# EAGLE design kameleon-core (EAGLE 9.4.2)
Kameleon Schematic
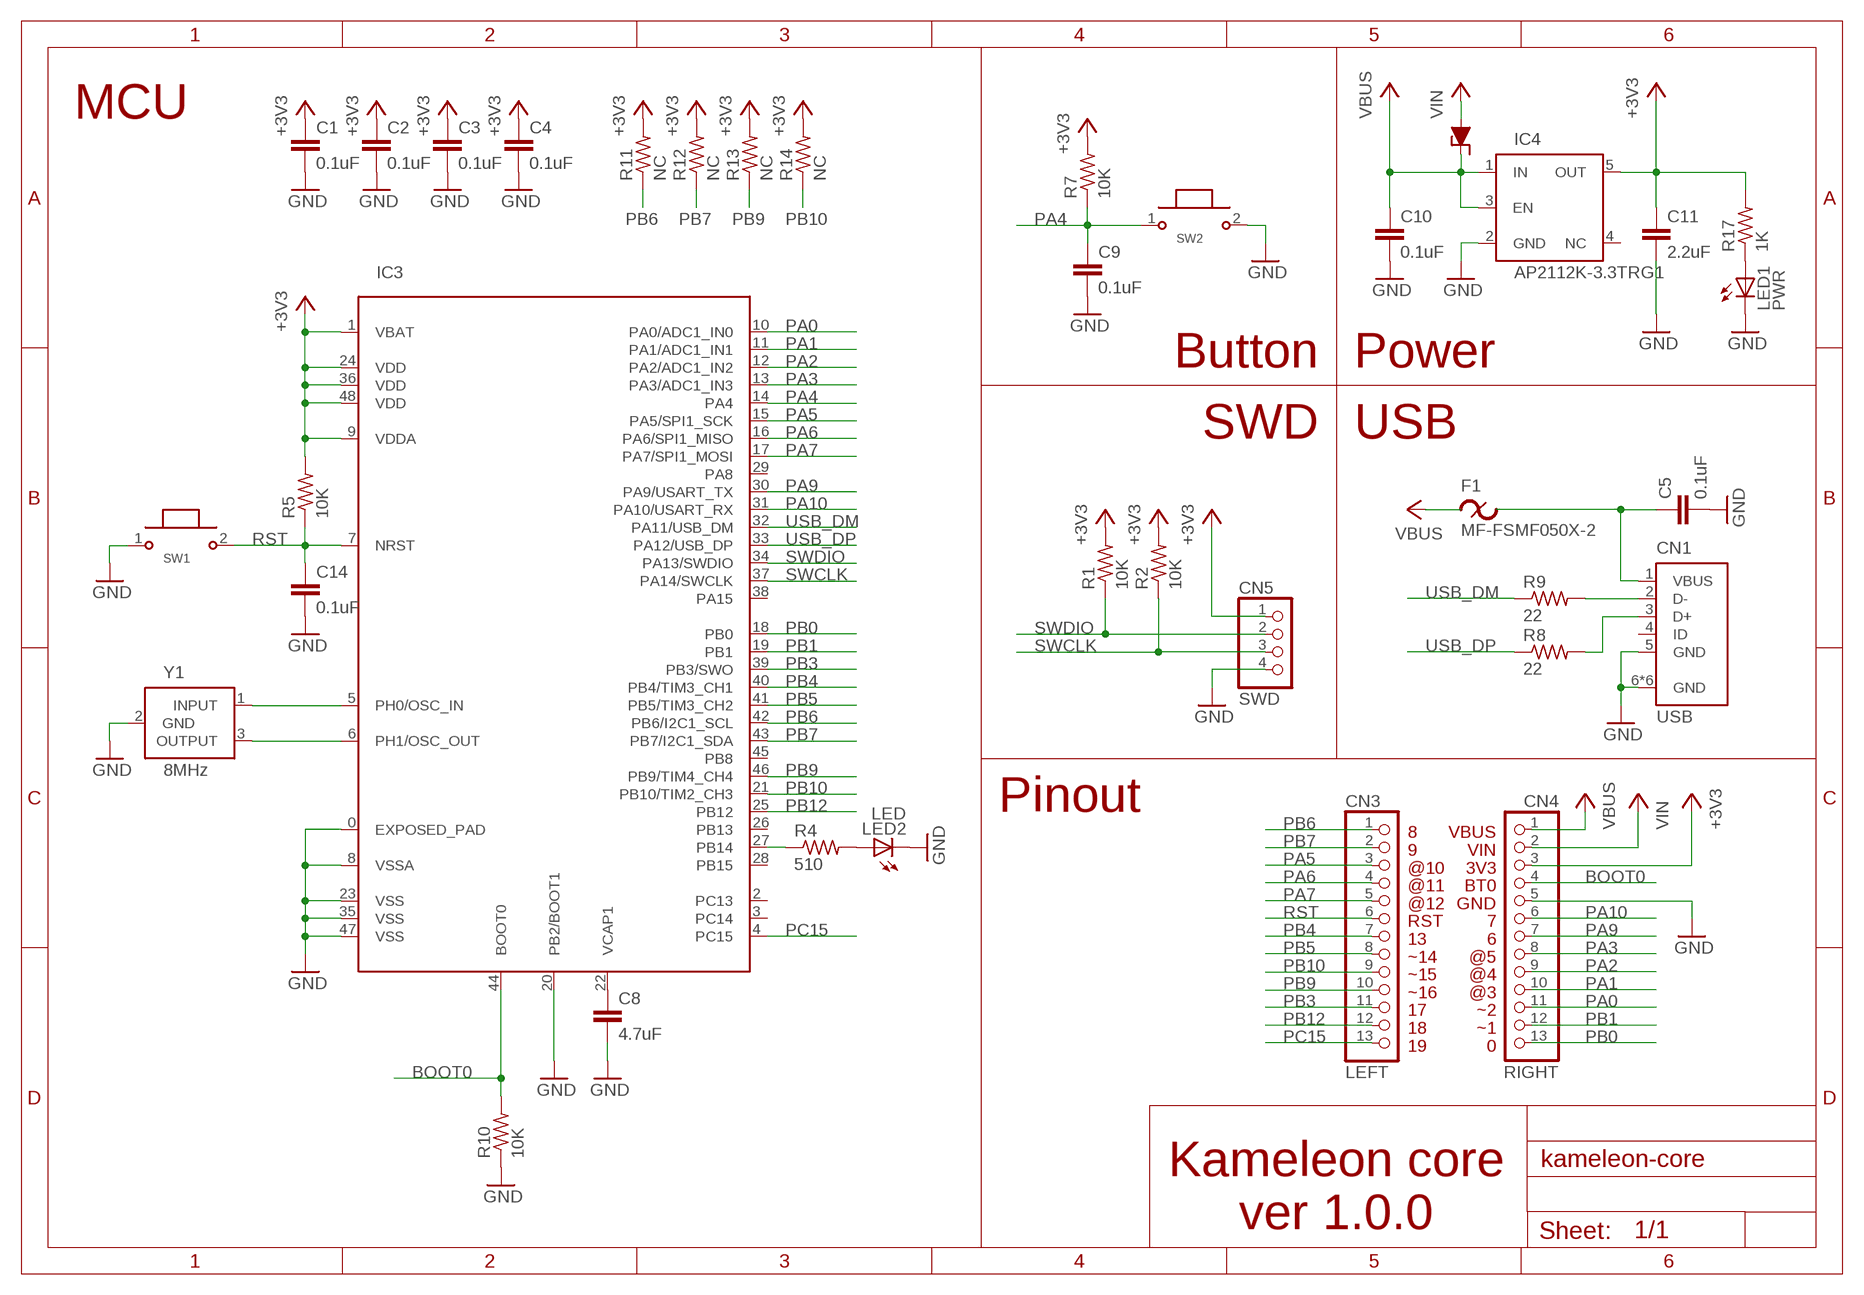
[diagram p0: schematic, sheet 1]

## Parts
C1  0.1uF  CAP  [1608]
C2  0.1uF  CAP  [1608]
C3  0.1uF  CAP  [1608]
C4  0.1uF  CAP  [1608]
C5  0.1uF  CAP  [1608]
C8  4.7uF  CAPB  [2012]
C9  0.1uF  CAP  [1608]
C10  0.1uF  CAP  [1608]
C11  2.2uF  CAPB  [2012]
C14  0.1uF  CAP  [1608]
CN1  USB  1050170001  [1050170001]
CN3  LEFT  PINHD-1X13  [1X13]
CN4  RIGHT  PINHD-1X13  [1X13]
CN5  SWD  PINHD-1X4  [1X04]
D1  MBR120VLSF  [SOD-123FL]
F1  MF-FSMF050X-2  [1608]
IC3  STM32F411CE/UFQFPN48  [UFQFPN48]
IC4  AP2112K-3.3TRG1  [SOT25]
LED1  PWR  LED  [D1608]
LED2  LED  [D1608]
R1  10K  RES  [1608]
R2  10K  RES  [1608]
R4  510  RES  [1608]
R5  10K  RES  [1608]
R7  10K  RES  [1608]
R8  22  RES  [1608]
R9  22  RES  [1608]
R10  10K  RES  [1608]
R11  NC  RES  [1608]
R12  NC  RES  [1608]
R13  NC  RES  [1608]
R14  NC  RES  [1608]
R17  1K  RES  [1608]
SW1  NRST  NW3-A03-05  [NW3-A03-05]
SW2  BTN  NW3-A03-05  [NW3-A03-05]
Y1  8MHz  CSTCE8M00G55Z-R0  [R0]

## Nets
+3V3: C1.1 C2.1 C3.1 C4.1 C11.1 CN4.3 CN5.1 IC3.1(VBAT) IC3.9(VDDA) IC3.24(VDD) IC3.36(VDD) IC3.48(VDD) IC4.5(OUT) R1.2 R2.2 R5.2 R7.2 R11.2 R12.2 R13.2 R14.2 R17.2
BOOT0: CN4.4 IC3.44(BOOT0) R10.2
GND: C1.2 C2.2 C3.2 C4.2 C5.2 C8.2 C9.2 C10.2 C11.2 C14.2 CN1.5(GND) CN1.6(GND) CN1.7(GND) CN1.8(GND) CN1.9(GND) CN1.10(GND) CN1.11(GND) CN4.5 CN5.4 IC3.0(EXPOSED_PAD) IC3.8(VSSA) IC3.20(PB2/BOOT1) IC3.23(VSS) IC3.35(VSS) IC3.47(VSS) IC4.2(GND) LED1.2(C) LED2.2(C) R10.1 SW1.1 SW2.2 Y1.2(GND)
N$3: C8.1 IC3.22(VCAP1)
N$4: IC3.5(PH0/OSC_IN) Y1.1(INPUT)
N$5: IC3.6(PH1/OSC_OUT) Y1.3(OUTPUT)
N$6: CN1.2(D-) R9.2
N$7: IC3.27(PB14) R4.1
N$8: LED2.1(A) R4.2
N$9: CN1.3(D+) R8.2
N$10: C5.1 CN1.1(VBUS) F1.2
N$11: LED1.1(A) R17.1
PA0: CN4.11 IC3.10(PA0/ADC1_IN0)
PA1: CN4.10 IC3.11(PA1/ADC1_IN1)
PA2: CN4.9 IC3.12(PA2/ADC1_IN2)
PA3: CN4.8 IC3.13(PA3/ADC1_IN3)
PA4: C9.1 IC3.14(PA4) R7.1 SW2.1
PA5: CN3.3 IC3.15(PA5/SPI1_SCK)
PA6: CN3.4 IC3.16(PA6/SPI1_MISO)
PA7: CN3.5 IC3.17(PA7/SPI1_MOSI)
PA9: CN4.7 IC3.30(PA9/USART_TX)
PA10: CN4.6 IC3.31(PA10/USART_RX)
PB0: CN4.13 IC3.18(PB0)
PB1: CN4.12 IC3.19(PB1)
PB3: CN3.11 IC3.39(PB3/SWO)
PB4: CN3.7 IC3.40(PB4/TIM3_CH1)
PB5: CN3.8 IC3.41(PB5/TIM3_CH2)
PB6: CN3.1 IC3.42(PB6/I2C1_SCL) R11.1
PB7: CN3.2 IC3.43(PB7/I2C1_SDA) R12.1
PB9: CN3.10 IC3.46(PB9/TIM4_CH4) R13.1
PB10: CN3.9 IC3.21(PB10/TIM2_CH3) R14.1
PB12: CN3.12 IC3.25(PB12)
PC15: CN3.13 IC3.4(PC15)
RST: C14.1 CN3.6 IC3.7(NRST) R5.1 SW1.2
SWCLK: CN5.3 IC3.37(PA14/SWCLK) R2.1
SWDIO: CN5.2 IC3.34(PA13/SWDIO) R1.1
USB_DM: IC3.32(PA11/USB_DM) R9.1
USB_DP: IC3.33(PA12/USB_DP) R8.1
VBUS: C10.1 CN4.1 D1.2 F1.1 IC4.1(IN) IC4.3(EN)
VIN: CN4.2 D1.1
Unconnected: CN1.4(ID) IC3.2(PC13) IC3.3(PC14) IC3.26(PB13) IC3.28(PB15) IC3.29(PA8) IC3.38(PA15) IC3.45(PB8) IC4.4(NC)

## Notes on the sheet
- MCU
- Button | Power
- SWD | USB
- Pinout
- 8
  9
  @10
  @11
  @12
  RST
  13
  ~14
  ~15
  ~16
  17
  18
  19
- VBUS
  VIN
  3V3
  BT0
  GND
  7
  6
  @5
  @4
  @3
  ~2
  ~1
  0
- Kameleon core
  ver 1.0.0

## Library data of the parts
C1-C5 C8-C11 C14 = Kameleon:CAP: Capacitor
CN1 = Kameleon:1050170001: USB connector 1050170001 <https://www.molex.com/pdm_docs/sd/1050170001_sd.pdf>
CN3 CN4 = Kameleon:PINHD-1X13: Pin Header 1x13
CN5 = Kameleon:PINHD-1X4: Pin Header 1x4
D1 = Kameleon:MBR120VLSF: Rectifier MBR120VLSF <https://www.onsemi.cn/PowerSolutions/document/MBR120VLSFT1-D.PDF>
F1 = Kameleon:MF-FSMF050X-2: Fuse MF-FSMF050X-2 <https://kr.mouser.com/datasheet/2/54/ffsmf-777670.pdf>
IC3 = Kameleon:STM32F411CE/UFQFPN48: STM32F411CE <http://www.st.com/resource/en/datasheet/stm32f411re.pdf>
IC4 = Kameleon:AP2112K-3.3TRG1: Regulator AP2112K-3.3TRG1 <https://www.diodes.com/assets/Datasheets/AP2112.pdf>
LED1 LED2 = Kameleon:LED: LED
R1 R2 R4 R5 R7-R14 R17 = Kameleon:RES: Resistor
SW1 SW2 = Kameleon:NW3-A03-05: Button NW3-A03-05 <https://www.devicemart.co.kr/include/down.php?file=/data/goods/goodsfile/1322066_file_0.pdf&mode=goods&name=A03-05.pdf>
Y1 = Kameleon:CSTCE8M00G55Z-R0: Crystal CSTCE8M00G55Z <https://www.murata.com/en-sg/api/pdfdownloadapi?cate=&partno=CSTCE8M00G55Z-R0>

## Board
Kameleon Board
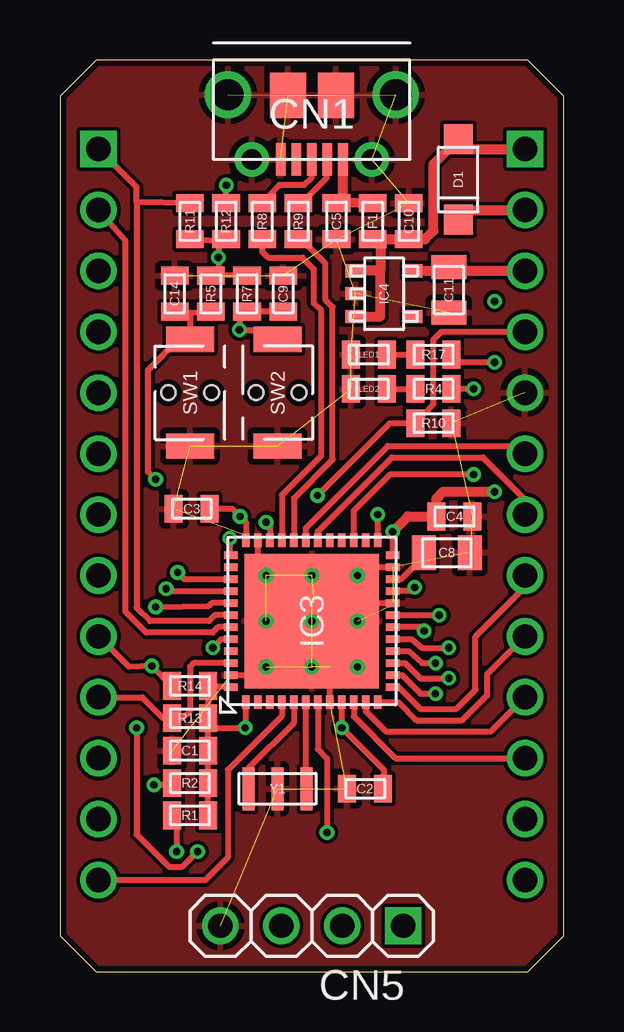
[diagram p1: board, top side]
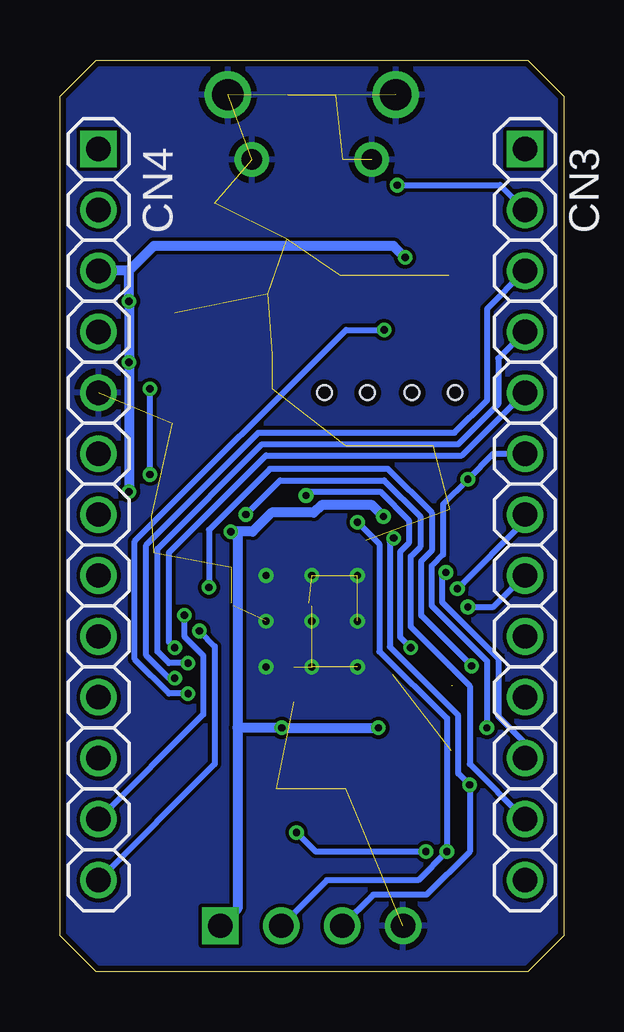
[diagram p2: board, bottom side, seen from below]

Size 21 x 38 mm. Coordinates in mm from the lower left corner, seen from the top.
Outline: 0,1.5 1.5,0 19.5,0 21,1.5 21,36.5 19.5,38 1.5,38 0,36.5 0,1.5
Copper layers (1*16): Top 0.035mm / dielectric 1.5mm / Bottom 0.035mm
Design rules "Kameleon": minimum track width 6mil, minimum drill 12mil, track to track 6mil, track to pad 6mil, pad to pad 6mil, via to via 6mil, smd to smd 0mil, copper to edge 10mil, drill to drill 10mil, minimum pad ring 10mil, minimum via ring 6mil, stop-mask expansion 2mil, vias tented up to drill 12mil, thermal gap 10mil

### Footprints (pad centres in the part's own frame; a part is rotated, then mirrored left to right if it is on the bottom)
1608 = smd 1.15 x 0.75: 1 0,0.75; 2 0,-0.75
2012 = smd 1.45 x 1: 1 0,0.95; 2 0,-0.95
1050170001 = smd 0.4 x 1.35: 1 1.3,0; 2 0.65,0; 3 0,0; 4 -0.65,0; 5 -1.3,0 | smd 1.5 x 1.9: 6 1,2.675; 7 -1,2.675 | drill 0.85 pad 1.45: 8 2.5,0; 9 -2.5,0 | drill 1.3 pad 1.9: 10 3.5,2.7; 11 -3.5,2.7
1X13 = drill 1.016 square: 1 -15.24,0 | drill 1.016: 2 -12.7,0; 3 -10.16,0; 4 -7.62,0; 5 -5.08,0; 6 -2.54,0; 7 0,0; 8 2.54,0; 9 5.08,0; 10 7.62,0; 11 10.16,0; 12 12.7,0; 13 15.24,0
1X04 = drill 1.016 square: 1 -3.81,0 | drill 1.016: 2 -1.27,0; 3 1.27,0; 4 3.81,0
SOD-123FL = smd 1.25 x 1.22: 1 -1.675,0; 2 1.675,0
UFQFPN48 = smd 5.6 x 5.6: 0 0,0 | smd 0.55 x 0.3: 1 -3.375,2.75; 2 -3.375,2.25; 3 -3.375,1.75; 4 -3.375,1.25; 5 -3.375,0.75; 6 -3.375,0.25; 7 -3.375,-0.25; 8 -3.375,-0.75; 9 -3.375,-1.25; 10 -3.375,-1.75; 11 -3.375,-2.25; 12 -3.375,-2.75; 25 3.375,-2.75; 26 3.375,-2.25; 27 3.375,-1.75; 28 3.375,-1.25; 29 3.375,-0.75; 30 3.375,-0.25; 31 3.375,0.25; 32 3.375,0.75; 33 3.375,1.25; 34 3.375,1.75; 35 3.375,2.25; 36 3.375,2.75 | smd 0.3 x 0.55: 13 -2.75,-3.375; 14 -2.25,-3.375; 15 -1.75,-3.375; 16 -1.25,-3.375; 17 -0.75,-3.375; 18 -0.25,-3.375; 19 0.25,-3.375; 20 0.75,-3.375; 21 1.25,-3.375; 22 1.75,-3.375; 23 2.25,-3.375; 24 2.75,-3.375; 37 2.75,3.375; 38 2.25,3.375; 39 1.75,3.375; 40 1.25,3.375; 41 0.75,3.375; 42 0.25,3.375; 43 -0.25,3.375; 44 -0.75,3.375; 45 -1.25,3.375; 46 -1.75,3.375; 47 -2.25,3.375; 48 -2.75,3.375
SOT25 = smd 0.8 x 0.55: 1 -1.2,0.95; 2 -1.2,0; 3 -1.2,-0.95; 4 1.2,-0.95; 5 1.2,0.95
D1608 = smd 1.15 x 0.75: 1 0,0.75; 2 0,-0.75
NW3-A03-05 = smd 1.05 x 2: 1 -2.225,0; 2 2.225,0 | hole 0.6: 0,0.9; 0,-0.9
R0 = smd 0.5 x 1.8: 1 1.2,0; 2 0,0; 3 -1.2,0

### Placement (x,y rotation side)
C1  5.42,9.21 270 top
C2  12.72,7.62 270 top
C3  5.5,19.29 270 top
C4  16.45,18.97 90 top
C5  11.53,31.27 0 top
C8  16.14,17.46 90 top
C9  9.31,28.26 180 top
C10  14.55,31.27 180 top
C11  16.21,28.42 0 top
C14  4.79,28.26 180 top
CN1  10.5,33.85 0 top
CN3  1.61,19.05 270 bottom
CN4  19.39,19.05 270 bottom
CN5  10.5,1.91 180 top
D1  16.61,33.02 90 top
F1  13.04,31.27 180 top
IC3  10.5,14.61 90 top
IC4  13.52,28.26 0 top
LED1  12.88,25.72 270 top
LED2  12.88,24.29 270 top
R1  5.42,6.51 90 top
R2  5.42,7.86 90 top
R4  15.58,24.29 270 top
R5  6.29,28.26 180 top
R7  7.8,28.26 180 top
R8  8.44,31.27 180 top
R9  9.94,31.27 180 top
R10  15.58,22.86 270 top
R11  5.42,31.27 0 top
R12  6.93,31.27 0 top
R13  5.42,10.56 90 top
R14  5.42,11.91 90 top
R17  15.58,25.72 90 top
SW1  5.42,24.13 90 top
SW2  9.07,24.13 270 top
U$1  [LOGO_VECTOR]  14.31,20.56 0 bottom
Y1  9.07,7.62 180 top

### Tracks (layer width: path | path; a pad name or v marks a point on that pad's centre or on a via)
+3V3  (via drill 0.3)
  Top 0.254: R5.2 6.61,29.06 | R11.2 6.61,30.47 | 6.61,30.47 v6.61,29.77 6.61,29.06 | R12.2 6.61,30.47 | 6.61,29.06 R7.2 | IC3.24 v13.88,18.34 | R17.2 16.7,25.4 v18.12,25.4 | IC3.9 v11.75,10.16 13.52,8.39 C2.1 | 7.75,18.1 IC3.36 7.75,18.73 v7.51,18.97 7.19,19.29 C3.1 | IC3.1 7.75,10.16 v7.72,10.16 6.17,10.16 | R1.2 R2.2 C1.1 6.17,10.16 | IC3.48 6.22,11.86 R14.2 R13.2 6.17,10.16 | IC4.5 | 16.21,29.21
  Top 0.406: C11.1 16.21,29.21 | 16.21,29.21 CN4.3 | IC4.5 16.21,29.21 | v13.88,18.34 14.51,18.97 C4.1 15.7,19.73 15.98,20 v18.12,20
  Bottom 0.406: v7.72,10.16 v11.75,10.16 13.6,10.16 | v18.12,20 v18.12,25.4 v18.12,27.94 18.12,29.21 | 18.12,29.21 CN4.3 | 13.6,10.16 13.6,2.62 CN5.1 | 13.6,18.34 13.6,10.16 | v7.51,18.97 7.99,19.45 10.1,19.45 10.42,19.13 12.17,19.13 12.96,18.34 13.6,18.34 | 13.6,18.34 v13.88,18.34 | v6.61,29.77 7.09,30.24 17.09,30.24 18.12,29.21
BOOT0  (via drill 0.3)
  Top 0.254: CN4.4 15.9,26.67 15.58,26.35 15.58,23.66 R10.2 13.75,22.86 v10.74,19.84 | v6.37,13.49 6.73,13.86 IC3.44
  Bottom 0.254: v10.74,19.84 10.58,20 7.64,20 6.45,18.81 6.45,17.86 6.81,17.5 6.81,13.93 v6.37,13.49
GND  (via drill 0.3)  (35 unrouted)
  Top 0.152: IC3.20 13.76,15.24 | 10.5,15.24 10.62,15.36
  Top 0.254: IC3.47 8.25,12.36 v8.6,12.7 | v8.6,16.51 8.25,16.86 IC3.35 | v12.41,16.51 12.75,16.86 IC3.23 | IC3.8 11.25,12.7 v12.41,12.7 | 10.62,15.36 IC3.20
  other vias: 10.5,16.51 8.6,14.61 10.5,14.61 12.41,14.61 10.5,12.7
  pour Bottom: 1.5,38 19.5,38 21,36.5 21,1.5 19.5,0 1.5,0 0,1.5 0,36.5
  pour Top: 1.5,38 19.5,38 21,36.5 21,1.5 19.5,0 1.5,0 0,1.5 0,36.5
N$3
  Top 0.254: IC3.22 14.23,16.36 14.35,16.47 14.55,16.67 15.19,17.31 C8.1
N$4
  Top 0.254: IC3.5 9.75,10.36 7.87,8.48 Y1.1
N$5
  Top 0.254: Y1.3 10.25,7.64 IC3.6
N$6
  Top 0.254: R9.2 10.11,32.07 11.13,33.1 11.13,33.84 CN1.2
N$7  (via drill 0.3)
  Top 0.254: v17.25,24.29 R4.1 | IC3.27 12.25,19.21 13.75,20.72 v17.25,20.72
  Bottom 0.254: v17.25,20.72 v17.25,24.29
N$8
  Top 0.254: LED2.1 R4.2
N$9
  Top 0.254: R8.2 9.14,32.78 10.18,32.78 10.5,33.1 CN1.3
N$10
  Top 0.254: C5.1 11.8,32.07
  Top 0.406: CN1.1 11.8,32.07 F1.2
N$11
  Top 0.254: LED1.1 R17.1
PA0
  Top 0.254: IC3.10 12.25,10.63 13.99,8.89 CN4.11
PA1
  Top 0.254: IC3.11 12.75,10.85 13.6,10 17.96,10 CN4.10
PA2
  Top 0.254: IC3.12 14.11,11.23 14.87,10.48 16.77,10.48 17.8,11.51 17.8,12.38 CN4.9
PA3
  Top 0.254: IC3.13 14.12,11.86 15.02,10.95 16.53,10.95 17.33,11.75 17.33,13.97 19.39,16.03 CN4.8
PA4  (via drill 0.3)
  Top 0.254: IC3.14 14.26,12.36 15.02,11.59 v15.66,11.59 | 9.15,27.46 C9.1 R7.1 7.48,27.14 v7.48,26.75 8.68,26.75 SW2.1 9.15,26.35
  Bottom 0.254: v7.48,26.75 9.07,26.75 17.88,17.94 17.88,13.02 16.45,11.59 v15.66,11.59
PA5  (via drill 0.3)
  Top 0.254: IC3.15 14.39,12.86 15.02,12.22 v16.21,12.22
  Bottom 0.254: CN3.3 3.2,27.62 3.2,23.81 4.55,22.46 12.72,22.46 17.41,17.78 17.41,13.18 16.45,12.22 v16.21,12.22
PA6  (via drill 0.3)
  Top 0.254: IC3.16 14.53,13.36 15.1,12.86 v15.66,12.86
  Bottom 0.254: CN3.4 2.72,25.56 2.72,23.65 4.39,21.99 12.56,21.99 16.93,17.62 16.93,13.34 16.45,12.86 v15.66,12.86
PA7  (via drill 0.3)
  Top 0.254: IC3.17 14.66,13.86 15.1,13.49 v16.21,13.49
  Bottom 0.254: CN3.5 4.23,21.51 12.41,21.51 16.45,17.46 16.45,13.73 v16.21,13.49
PA9
  Top 0.254: IC3.30 10.75,18.35 13.83,21.43 17.64,21.43 19.39,19.68 CN4.7
PA10
  Top 0.254: IC3.31 10.25,18.48 13.68,21.91 19.07,21.91 CN4.6
PB0  (via drill 0.3)
  Top 0.254: v15.18,14.2 15.02,14.36 IC3.18
  Bottom 0.254: v15.18,14.2 14.55,13.56 14.55,8.65 CN4.13
PB1  (via drill 0.3)
  Top 0.254: IC3.19 v15.82,14.86
  Bottom 0.254: v15.82,14.86 15.82,13.97 15.02,13.18 15.02,10.72 CN4.12
PB3  (via drill 0.3)
  Top 0.254: v4.9,16.63 5.18,16.36 IC3.39
  Bottom 0.254: CN3.11 1.61,9.53 2.72,10.64 2.72,13.06 5.06,15.4 5.06,16.47 v4.9,16.63
PB4  (via drill 0.3)
  Top 0.254: v4.43,15.95 4.53,15.86 IC3.40
  Bottom 0.254: v4.43,15.95 1.61,18.77 CN3.7
PB5  (via drill 0.3)
  Top 0.254: v3.99,15.2 6.21,15.24 6.33,15.36 IC3.41
  Bottom 0.254: v3.99,15.2 2.92,15.2 CN3.8
PB6
  Top 0.254: R11.1 3.2,32.07 | 3.2,32.07 3.2,32.7 CN3.1 | 3.2,32.07 3.2,15.16 3.75,14.61 6.21,14.61 6.46,14.86 IC3.42
PB7  (via drill 0.3)
  Top 0.254: CN3.2 2.72,30.48 2.72,15 3.59,14.13 6.37,14.13 6.6,14.36 IC3.43 | R12.1 v6.93,32.78
  Bottom 0.254: v6.93,32.78 2.64,32.78 CN3.2
PB9
  Top 0.254: IC3.46 5.58,12.86 5.42,12.7 5.42,10.87 5.1,10.56 R13.1 4.31,10.56 3.44,11.43 CN3.10
PB10  (via drill 0.3)  (1 unrouted)
  Top 0.254: v14.79,16.01 14.63,15.86 IC3.21 | CN3.9 2.88,12.7 v3.83,12.74 4.63,11.91
  Bottom 0.254: v14.79,16.01 14.79,18.41 12.25,20.95 7.33,20.95 5.5,19.13 5.5,17.54 5.94,17.11 5.94,14.84 v3.83,12.74
PB12  (via drill 0.3)
  Top 0.254: IC3.25 v13.25,19.05
  Bottom 0.254: v13.25,19.05 11.82,20.48 7.48,20.48 5.98,18.97 5.98,17.7 6.37,17.3 6.37,14.37 3.91,11.91 3.91,8.65 CN3.12
PC15
  Top 0.254: IC3.4 9.25,10.66 7.01,8.41 7.01,4.76 6.06,3.81 CN3.13
RST  (via drill 0.3)
  Top 0.254: C14.1 5.42,27.46 | 5.42,27.46 SW1.2 4.95,26.36 3.67,25.08 3.67,20.84 v3.99,20.52 | R5.1 5.42,27.46 | IC3.7 10.75,9.28 11.13,8.89 v11.13,5.79 | v3.2,10.16 3.2,5.71 4.55,4.37 5.1,4.37 v5.74,5
  Bottom 0.254: v3.2,10.16 3.2,12.94 5.5,15.24 5.5,16.91 5.02,17.38 5.02,19.49 v3.99,20.52 2.92,21.59 CN3.6 | v11.13,5.79 10.34,5 v5.74,5
SWCLK  (via drill 0.3)
  Top 0.254: R2.1 4.54,7.78 v3.91,7.78 | IC3.37 7.09,17.36 v7.09,18.07
  Bottom 0.254: CN5.3 7.94,3.2 5.71,3.2 3.91,5 v3.91,7.78 4.39,8.26 4.39,10.68 7.25,13.53 7.25,17.91 v7.09,18.07
SWDIO  (via drill 0.3)
  Top 0.254: 4.63,6.5 R1.1 4.86,6.26 v4.86,5 | v8.59,18.73 8.75,18.57 IC3.34
  Bottom 0.254: CN5.2 9.87,3.81 6.06,3.81 v4.86,5 4.86,10.56 7.68,13.34 7.68,17.82 v8.59,18.73 8.59,18.65
USB_DM
  Top 0.254: R9.1 10.11,30.47 11.06,29.53 11.06,28.02 11.37,27.7 11.37,21.35 9.75,19.73 IC3.32
USB_DP
  Top 0.254: R8.1 8.44,30 8.67,29.77 10.1,29.77 10.58,29.29 10.58,27.86 10.9,27.54 10.9,21.51 9.25,19.86 IC3.33
VBUS
  Top 0.406: F1.1 13.36,30.47 | 13.36,30.47 13.36,29.21 | 13.36,29.21 IC4.1 | IC4.3 13.36,27.31 13.36,27.3 13.36,29.21 | CN4.1 17.02,34.29 D1.2 15.58,33.66 15.58,30.88 15.23,30.52 C10.1 13.36,30.52 13.36,30.47
VIN
  Top 0.406: D1.1 17.02,31.75 CN4.2

### Text on the board
tTest: 8 | VBUS | 9 | VIN | @10 | 3V3 | @11 | BT0 | ON | @12 | LED0 | GND | RST | 7 | RST | BTN0 | 13 | 6 | 14 | @5 | ~ | 15 | @4 | ~ | 16 | ~ | @3 | 17 | ~ | 2 | ~ | 18 | 1 | ~ | 19 | PWM= / ADC=@ | 0
bTest: SCL | I2C0 | SDA | http://kameleon.io | CLK | MISO | SPI0 | MOSI | RX | UART0 | MISO | TX | SPI1 | MOSI | RX | SCL | TX | I2C1 | SDA | RTS | UART1 | CTS | CLK | SPI1 | GND | CLK | DIO | 3V3
200bmp: http://kameleon.io